# Altium project Temp-Humidity-logger.PrjPcb
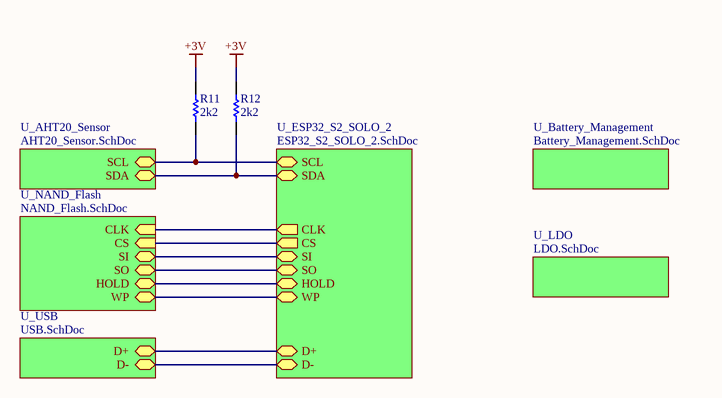
[diagram p0: Top_Design.SchDoc]
3 sheets, 18 parts. Net scope: hierarchical (ports join the sheet entries above them; power ports are global).
Board file: Main-PCB.PcbDoc
Sheets:
  Top_Design.SchDoc
    U_AHT20_Sensor = AHT20_Sensor.SchDoc
    U_ESP32_S2_SOLO_2 = ESP32_S2_SOLO_2.SchDoc

## Sheet Top_Design.SchDoc
size A4; SheetNumber: 1; SheetTotal: 7

### Parts
R11  value 2k2  [Wurth 0603 Resistor]  (hidden comment: Generic Resistor 2k2 0603)
R12  value 2k2  [Wurth 0603 Resistor]  (hidden comment: Generic Resistor 2k2 0603)

### Sub-sheets
U_AHT20_Sensor = AHT20_Sensor.SchDoc: SDA (bidir), SCL (bidir)
U_Battery_Management = Battery_Management.SchDoc (file not in this document): no entries
U_ESP32_S2_SOLO_2 = ESP32_S2_SOLO_2.SchDoc: SCL (bidir), SDA (bidir), D- (bidir), D+ (bidir), HOLD (bidir), WP (bidir), SI (bidir), SO (bidir), CS (out), CLK (out)
U_LDO = LDO.SchDoc (file not in this document): no entries
U_NAND_Flash = NAND_Flash.SchDoc (file not in this document): SI (bidir), HOLD (bidir), SO (bidir), WP (bidir), CLK (in), CS (in)
U_USB = USB.SchDoc (file not in this document): D- (bidir), D+ (bidir)

### Nets
+3V: R11.2 R12.2
SCL: R11.1 ; sheet U_AHT20_Sensor/SCL, sheet U_ESP32_S2_SOLO_2/SCL
SDA: R12.1 ; sheet U_AHT20_Sensor/SDA, sheet U_ESP32_S2_SOLO_2/SDA
NetIC2_13: sheet U_ESP32_S2_SOLO_2/D-, sheet U_USB/D-
NetIC2_14: sheet U_ESP32_S2_SOLO_2/D+, sheet U_USB/D+
NetIC2_17: sheet U_ESP32_S2_SOLO_2/HOLD, sheet U_NAND_Flash/HOLD
NetIC2_18: sheet U_ESP32_S2_SOLO_2/CS, sheet U_NAND_Flash/CS
NetIC2_19: sheet U_ESP32_S2_SOLO_2/SI, sheet U_NAND_Flash/SI
NetIC2_20: sheet U_ESP32_S2_SOLO_2/CLK, sheet U_NAND_Flash/CLK
NetIC2_21: sheet U_ESP32_S2_SOLO_2/SO, sheet U_NAND_Flash/SO
NetIC2_22: sheet U_ESP32_S2_SOLO_2/WP, sheet U_NAND_Flash/WP

## Sheet AHT20_Sensor.SchDoc
size A4; SheetNumber: 5; SheetTotal: 7
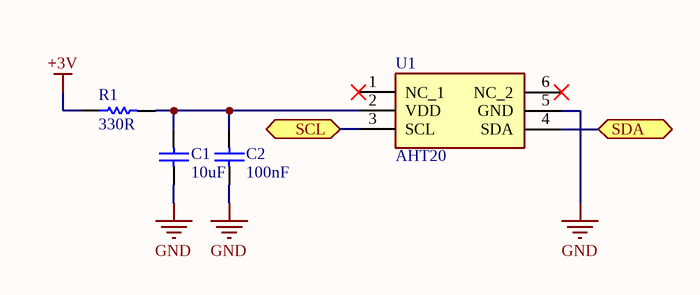
[diagram p1: AHT20_Sensor.SchDoc]

### Parts
C1  value 10uF  [Wurth 0603 capacitor]  (hidden comment: Generic Capacitor 10uF 0603)
C2  value 100nF  [Wurth 0603 capacitor]  (hidden comment: Generic Capacitor 100nF 0603)
R1  value 330R  [Wurth 0603 Resistor]  (hidden comment: Generic Resistor 330R 0603)
U1  AHT20  [AHT20]

### Ports
SCL (bidir), SDA (bidir)

### Nets
+3V: R1.1
GND: C1.1 C2.1 U1.5(GND)
SCL: U1.3(SCL) ; port SCL
SDA: U1.4(SDA) ; port SDA
NetC1_2: C1.2 C2.2 R1.2 U1.2(VDD)

Not connected (* = marked no-connect by the designer): U1 1(NC_1)* 6(NC_2)*

### Library data of the parts
U1 = AHT20: Undefined or Miscellaneous; Manufacturer_Name: Aosong; Datasheet Link: http://www.aosong.com/userfiles/files/media/Data%20Sheet%20AHT20.pdf; Height: 1.1mm; Manufacturer_Part_Number: AHT20

## Sheet ESP32_S2_SOLO_2.SchDoc
size A4; SheetNumber: 2; SheetTotal: 7
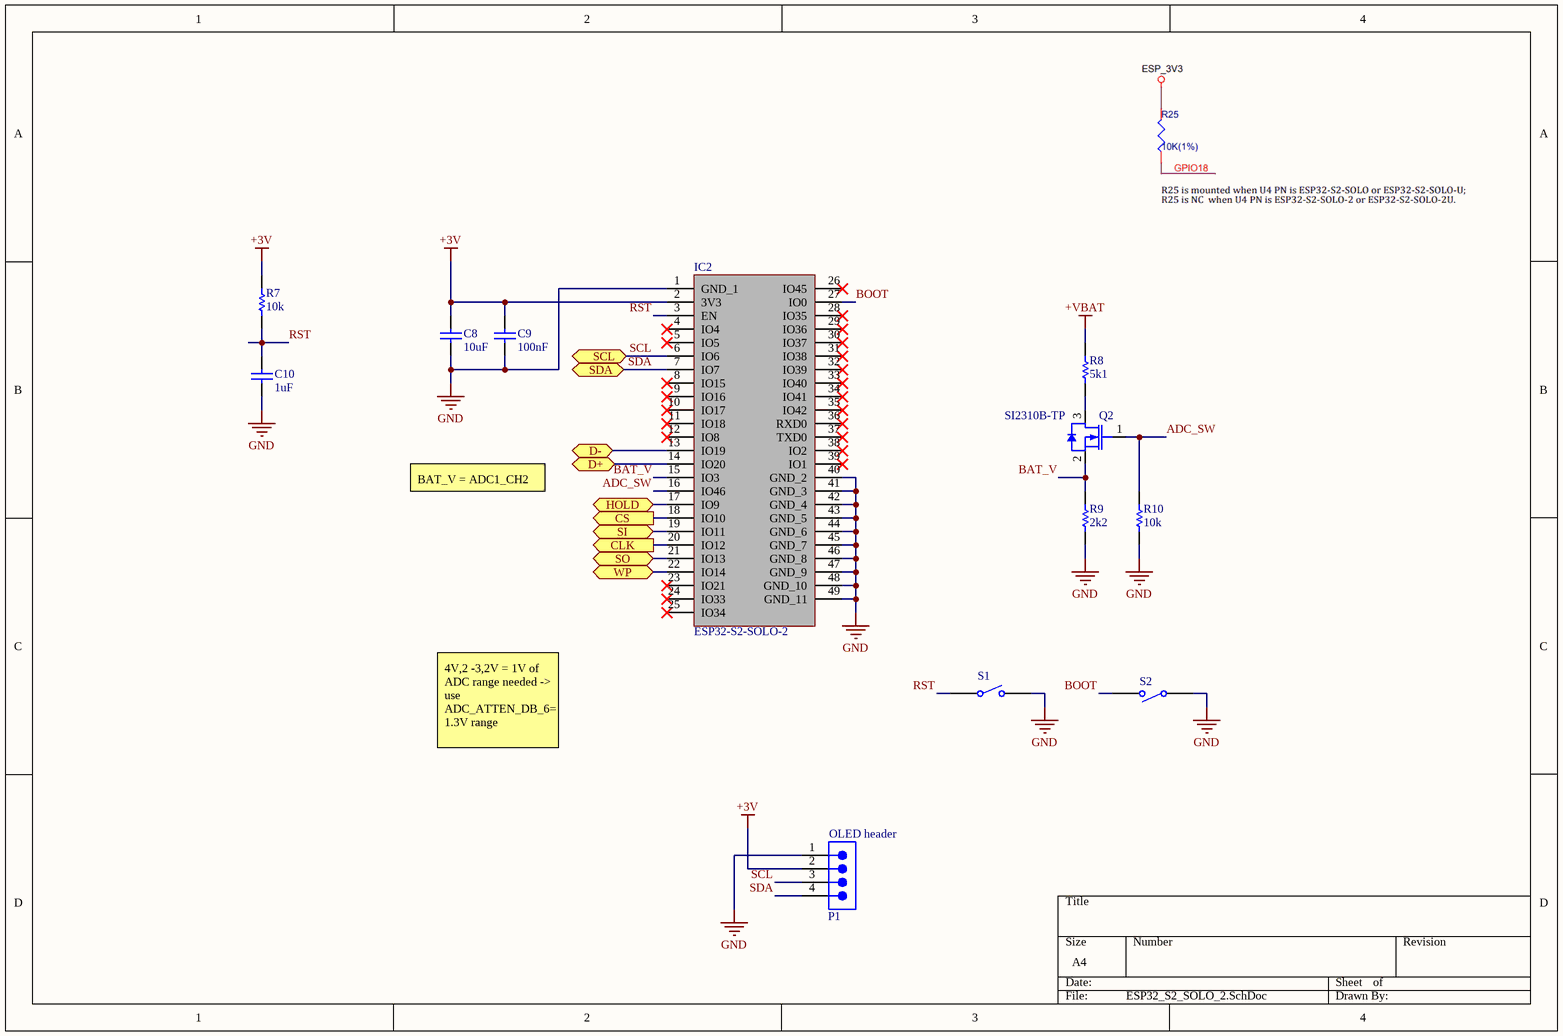
[diagram p2: ESP32_S2_SOLO_2.SchDoc]

### Parts
C8  value 10uF  [Wurth 0603 capacitor]  (hidden comment: Generic Capacitor 10uF 0603)
C9  value 100nF  [Wurth 0603 capacitor]  (hidden comment: Generic Capacitor 100nF 0603)
C10  value 1uF  [Wurth 0603 capacitor]  (hidden comment: Generic Capacitor 1uF 0603)
IC2  ESP32-S2-SOLO-2  [ESPRESSIF ESP32S2SOLO2]
P1  OLED header  [4x1 2.54mm F]
Q2  SI2310B-TP  [MCC SOT-23-3]
R7  value 10k  [Wurth 0603 Resistor]  (hidden comment: Generic Resistor 10k 0603)
R8  value 5k1  [0805 Resistor]  (hidden comment: Generic Resistor 5k1 0805)
R9  value 2k2  [Wurth 0603 Resistor]  (hidden comment: Generic Resistor 2k2 0603)
R10  value 10k  [Wurth 0603 Resistor]  (hidden comment: Generic Resistor 10k 0603)
S1  TS-1088R-02026  [TS1088R02026]  (value not drawn)
S2  TS-1088R-02026  [TS1088R02026]  (value not drawn)

### Ports
CLK (out), CS (out), D+ (bidir), D- (bidir), HOLD (bidir), SCL (bidir), SDA (bidir), SI (bidir), SO (bidir), WP (bidir)

### Nets
+3V: C8.2 C9.2 IC2.2(3V3) P1.2 R7.2
+VBAT: R8.2
GND: C8.1 C9.1 C10.1 IC2.1(GND_1) IC2.40(GND_2) IC2.41(GND_3) IC2.42(GND_4) IC2.43(GND_5) IC2.44(GND_6) IC2.45(GND_7) IC2.46(GND_8) IC2.47(GND_9) IC2.48(GND_10) IC2.49(GND_11) P1.1 R9.1 R10.1 S1.2 S2.1
ADC_SW: IC2.16(IO46) Q2.1(G) R10.2
BAT_V: IC2.15(IO3) Q2.2(S) R9.2
BOOT: IC2.27(IO0) S2.2
RST: C10.2 IC2.3(EN) R7.1 S1.1
SCL: IC2.6(IO6) P1.3 ; port SCL
SDA: IC2.7(IO7) P1.4 ; port SDA
NetIC2_13: IC2.13(IO19) ; port D-
NetIC2_14: IC2.14(IO20) ; port D+
NetIC2_17: IC2.17(IO9) ; port HOLD
NetIC2_18: IC2.18(IO10) ; port CS
NetIC2_19: IC2.19(IO11) ; port SI
NetIC2_20: IC2.20(IO12) ; port CLK
NetIC2_21: IC2.21(IO13) ; port SO
NetIC2_22: IC2.22(IO14) ; port WP
NetQ2_3: Q2.3(D) R8.1

Not connected (* = marked no-connect by the designer): IC2 4(IO4)* 5(IO5)* 8(IO15)* 9(IO16)* 10(IO17)* 11(IO18)* 12(IO8)* 23(IO21)* 24(IO33)* 25(IO34)* 26(IO45)* 28(IO35)* 29(IO36)* 30(IO37)* 31(IO38)* 32(IO39)* 33(IO40)* 34(IO41)* 35(IO42)* 36(RXD0)* 37(TXD0)* 38(IO2)* 39(IO1)*

### Notes on the sheet
- BAT_V = ADC1_CH2
- 4V,2 -3,2V = 1V of ADC range needed -> use ADC_ATTEN_DB_6= 1.3V range

### Library data of the parts
IC2 = Espressif ESP32-S2-SOLO-2: Integrated Circuit
P1 = 4P: WR-PHD Pin Header, THT, Vertical, pitch 2.54mm, 1 Row, 4P; Manufacturer Part Number: 61300411121; Manufacturer: Wurth Elektronik; Contact Resistance: 20mOhm; Rated Current: 3A; Working Voltage: 250V; Withstanding Voltage: 500V; Category: Board-to-Board Connectors; Match Code: WR-PHD; ComponentLink1Description: Website Link; ComponentLink1URL: https://www.we-online.com/redexpert/article/61300411121?ad; ComponentLink2Description: Datasheet Link; ComponentLink2URL: https://www.we-online.com/redexpert/spec/61300411121?ad; Mount: Through Hole; Operating Temperature Max: 105°C; Operating Temperature Min: -40°C; Packaging: Bag; Gender: Pin Header; Number of Pins: 4; Number of Rows: 1; Orientation: Vertical; Pitch: 2.54mm
Q2 = MCC SI2310B-TP: Power Field-Effect Transistor; Manufacturer: MCC; Supplier: Digikey; Supplier Part Number: 353-SI2310B-TPCT-ND; Manufacturer Part Number: SI2310B-TP; RoHS: Yes; Stock: 114263; Pricing: 1=0,36, 10=0,255, 100=0,1286, 500=0,10488, 1000=0,07782 (USD)
S1 S2 = XUNPU TS-1088R-02026

## Nets that join several sheets
+3V: Top_Design (R11.2 R12.2), AHT20_Sensor (R1.1), ESP32_S2_SOLO_2 (5 pins)
GND: AHT20_Sensor (C1.1 C2.1 U1.5), ESP32_S2_SOLO_2 (19 pins)
SCL: Top_Design (R11.1), AHT20_Sensor (U1.3), ESP32_S2_SOLO_2 (IC2.6 P1.3)
SDA: Top_Design (R12.1), AHT20_Sensor (U1.4), ESP32_S2_SOLO_2 (IC2.7 P1.4)